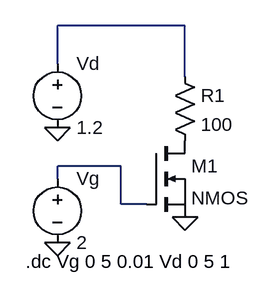
[diagram p0: schematic NMOS_transfer.asc]
NMOS_transfer.asc, the LTspice schematic file:
Version 4.1
SHEET 1 880 680
WIRE 320 16 160 16
WIRE 160 64 160 16
WIRE 320 80 320 16
WIRE 240 192 160 192
WIRE 160 208 160 192
WIRE 240 240 240 192
WIRE 272 240 240 240
FLAG 160 144 0
FLAG 160 288 0
FLAG 320 256 0
SYMBOL res 304 64 R0
SYMATTR InstName R1
SYMATTR Value 100
SYMBOL voltage 160 48 R0
WINDOW 123 0 0 Left 0
WINDOW 39 0 0 Left 0
SYMATTR InstName Vd
SYMATTR Value 1.2
SYMBOL voltage 160 192 R0
WINDOW 123 0 0 Left 0
WINDOW 39 0 0 Left 0
SYMATTR InstName Vg
SYMATTR Value 2
SYMBOL nmos 272 160 R0
SYMATTR InstName M1
TEXT 120 312 Left 2 !.dc Vg 0 5 0.01 Vd 0 5 1

The netlist it stands for:
* NMOS_transfer.asc
R1 N001 P001 100
Vd N001 0 1.2
Vg N002 0 2
M1 P001 N002 0 0 NMOS
.model NMOS NMOS
.model PMOS PMOS
.lib standard.mos
.dc Vg 0 5 0.01 Vd 0 5 1
.backanno
.end